# EAGLE schematic Arduino (EAGLE 7.2.0)
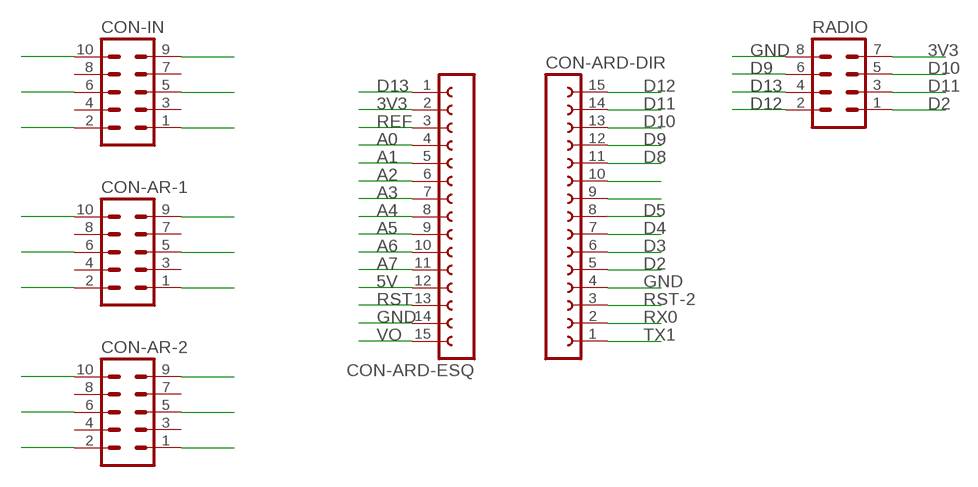
[diagram p0: schematic, sheet 1]

## Parts
CON-AR-1  MA05-2  [MA05-2]
CON-AR-2  MA05-2  [MA05-2]
CON-ARD-DIR  FE15-1  [FE15]
CON-ARD-ESQ  FE15-1  [FE15]
CON-IN  MA05-2  [MA05-2]
RADIO  MA04-2  [MA04-2]

## Nets
3V3: CON-ARD-ESQ.2 RADIO.7
5V: CON-ARD-ESQ.12 CON-IN.5 CON-IN.6
A0: CON-ARD-ESQ.4
A1: CON-ARD-ESQ.5
A2: CON-ARD-ESQ.6
A3: CON-ARD-ESQ.7
A4: CON-ARD-ESQ.8
A5: CON-ARD-ESQ.9
A6: CON-ARD-ESQ.10
A7: CON-ARD-ESQ.11
D2: CON-ARD-DIR.5 RADIO.1
D3: CON-ARD-DIR.6
D4: CON-ARD-DIR.7
D5: CON-AR-2.1 CON-AR-2.2 CON-ARD-DIR.8
D6: CON-AR-1.9 CON-AR-1.10 CON-ARD-DIR.9
D7: CON-AR-1.5 CON-AR-1.6 CON-ARD-DIR.10
D8: CON-AR-1.1 CON-AR-1.2 CON-ARD-DIR.11
D9: CON-ARD-DIR.12 RADIO.6
D10: CON-ARD-DIR.13 RADIO.5
D11: CON-ARD-DIR.14 RADIO.3
D12: CON-ARD-DIR.15 RADIO.2
D13: CON-ARD-ESQ.1 RADIO.4
GND: CON-ARD-DIR.4 CON-ARD-ESQ.14 CON-IN.1 CON-IN.2 RADIO.8
REF: CON-ARD-ESQ.3
RST: CON-ARD-ESQ.13
RST-2: CON-ARD-DIR.3
RX0: CON-AR-2.5 CON-AR-2.6 CON-ARD-DIR.2
TX1: CON-AR-2.9 CON-AR-2.10 CON-ARD-DIR.1
VO: CON-ARD-ESQ.15 CON-IN.9 CON-IN.10
Unconnected: CON-AR-1.3 CON-AR-1.4 CON-AR-1.7 CON-AR-1.8 CON-AR-2.3 CON-AR-2.4 CON-AR-2.7 CON-AR-2.8 CON-IN.3 CON-IN.4 CON-IN.7 CON-IN.8

## Library data of the parts
CON-AR-1 CON-AR-2 CON-IN = con-lstb:MA05-2: PIN HEADER; OC_FARNELL: unknown; OC_NEWARK: unknown
CON-ARD-DIR CON-ARD-ESQ = con-lsta:FE15-1: FEMALE HEADER; OC_FARNELL: unknown; OC_NEWARK: unknown
RADIO = con-lstb:MA04-2: PIN HEADER; OC_FARNELL: unknown; OC_NEWARK: unknown

## Net classes
0 default: width 0.762 mm